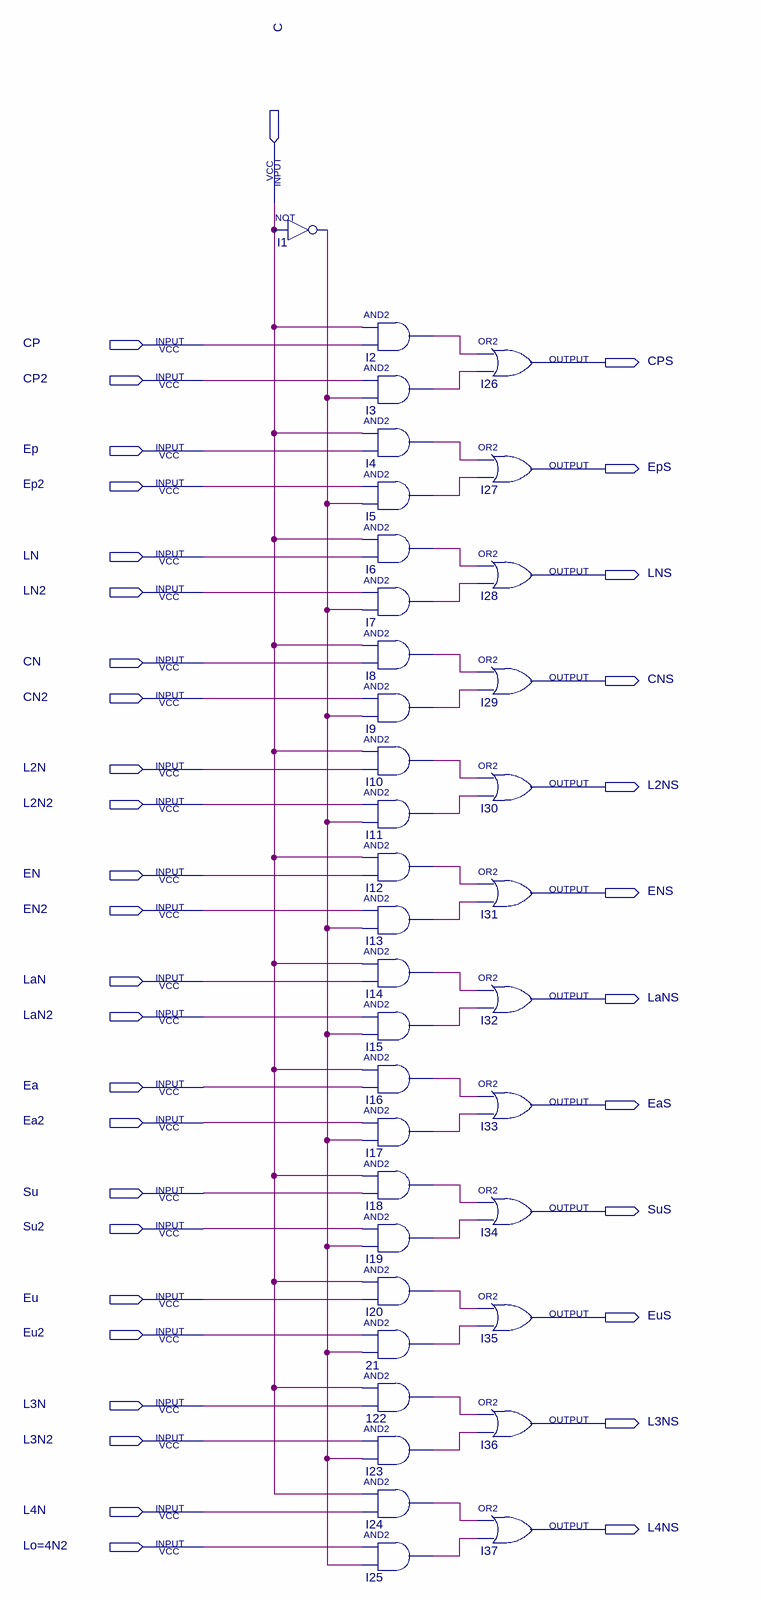
[diagram p0: schematic sheet]
// Quartus schematic Decididor.bdf as structural Verilog: 37 symbols, 37 pins
module Decididor (
  input  C,
  input  CP,
  input  CP2,
  input  Ep,
  input  Ep2,
  input  LN,
  input  LN2,
  input  CN,
  input  CN2,
  input  L2N,
  input  L2N2,
  input  EN,
  input  EN2,
  input  LaN,
  input  LaN2,
  input  Ea,
  input  Ea2,
  input  Su,
  input  Su2,
  input  Eu,
  input  Eu2,
  input  L3N,
  input  L3N2,
  input  L4N,
  input  \Lo=4N2 ,
  output CPS,
  output EpS,
  output LNS,
  output CNS,
  output L2NS,
  output ENS,
  output LaNS,
  output EaS,
  output SuS,
  output EuS,
  output L3NS,
  output L4NS
);

  wire I1_out, I2_out, I3_out, I4_out, I5_out, I6_out, I7_out, I8_out, I9_out, I10_out, I11_out, I12_out,
       I13_out, I14_out, I15_out, I16_out, I17_out, I18_out, I19_out, I20_out, I23_out, I24_out, I25_out,
       n21_out, n122_out;

  not I1 (I1_out, C);
  and I2 (I2_out, C, CP);
  and I3 (I3_out, CP2, I1_out);
  and I4 (I4_out, C, Ep);
  and I5 (I5_out, Ep2, I1_out);
  and I6 (I6_out, C, LN);
  and I7 (I7_out, LN2, I1_out);
  and I8 (I8_out, C, CN);
  and I9 (I9_out, CN2, I1_out);
  and I10 (I10_out, C, L2N);
  and I11 (I11_out, L2N2, I1_out);
  and I12 (I12_out, C, EN);
  and I13 (I13_out, EN2, I1_out);
  and I14 (I14_out, C, LaN);
  and I15 (I15_out, LaN2, I1_out);
  and I16 (I16_out, C, Ea);
  and I17 (I17_out, Ea2, I1_out);
  and I18 (I18_out, C, Su);
  and I19 (I19_out, Su2, I1_out);
  and I20 (I20_out, C, Eu);
  and u_21 (n21_out, Eu2, I1_out);
  and u_122 (n122_out, C, L3N);
  and I23 (I23_out, L3N2, I1_out);
  and I24 (I24_out, C, L4N);
  and I25 (I25_out, \Lo=4N2 , I1_out);
  or I26 (CPS, I2_out, I3_out);
  or I27 (EpS, I4_out, I5_out);
  or I28 (LNS, I6_out, I7_out);
  or I29 (CNS, I8_out, I9_out);
  or I30 (L2NS, I10_out, I11_out);
  or I31 (ENS, I12_out, I13_out);
  or I32 (LaNS, I14_out, I15_out);
  or I33 (EaS, I16_out, I17_out);
  or I34 (SuS, I18_out, I19_out);
  or I35 (EuS, I20_out, n21_out);
  or I36 (L3NS, n122_out, I23_out);
  or I37 (L4NS, I24_out, I25_out);
endmodule
